# Altium project Power PLC.PrjPcb
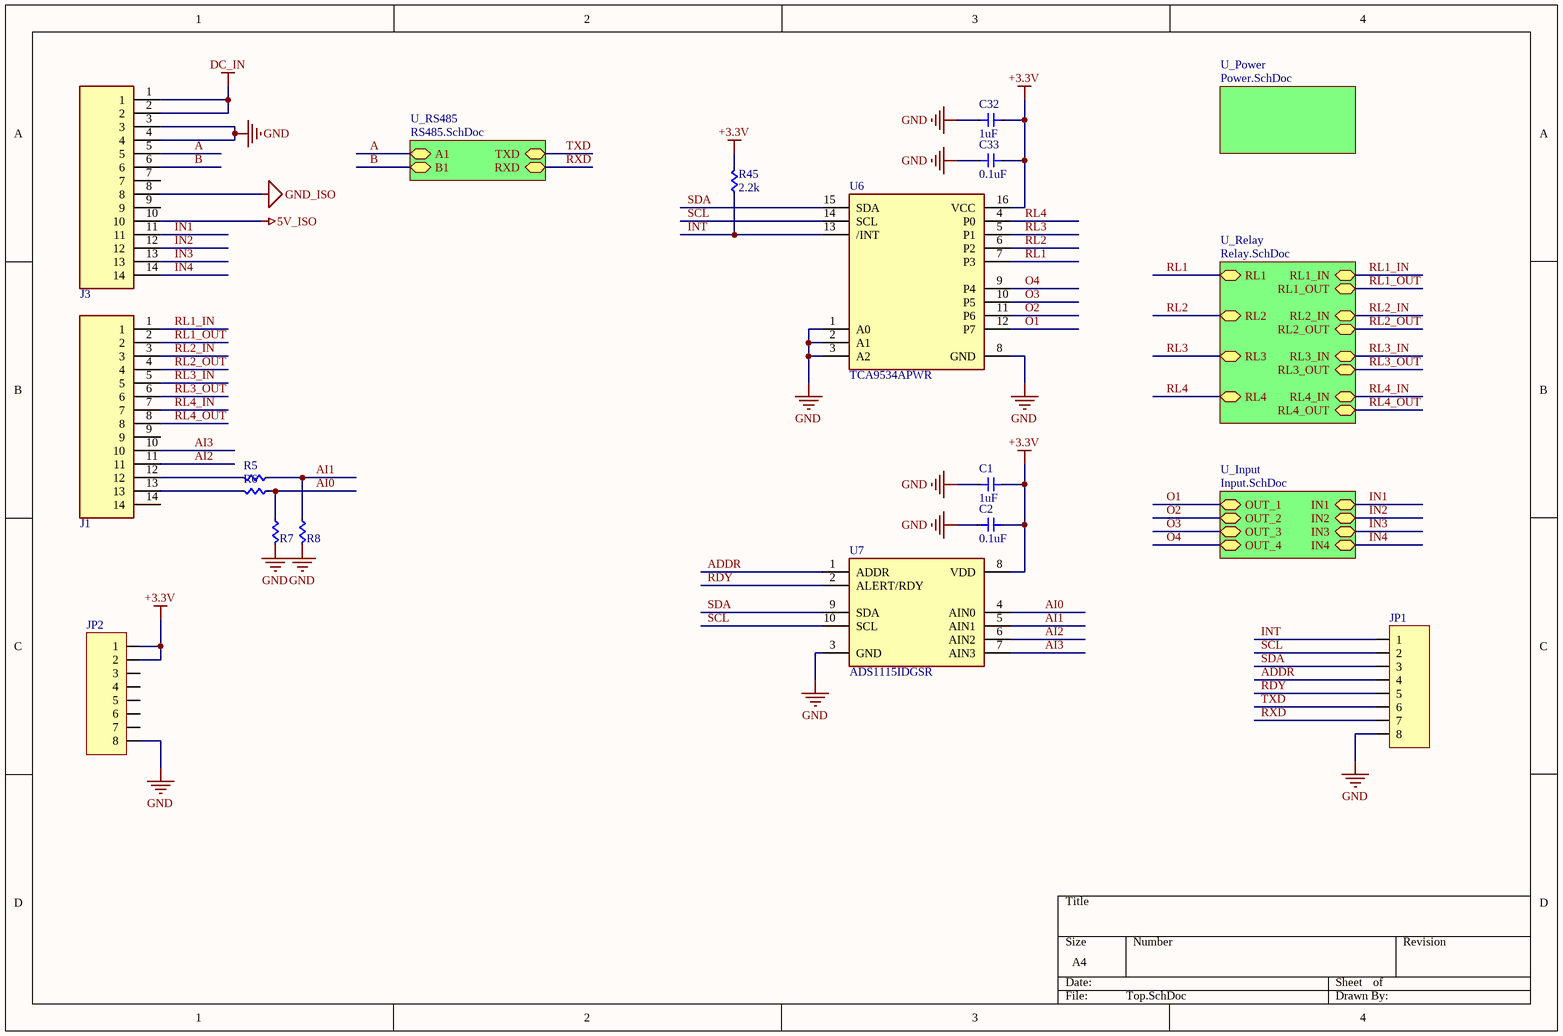
[diagram p0: Top.SchDoc]
5 sheets, 98 parts. Net scope: hierarchical (ports join the sheet entries above them; power ports are global).
Board file: PCB_PLC.PcbDoc
Sheets:
  Top.SchDoc
    U_Power = Power.SchDoc
    U_Relay = Relay.SchDoc
    U_Input = Input.SchDoc
    U_RS485 = RS485.SchDoc

## Sheet Top.SchDoc
size A4; SheetNumber: 1; SheetTotal: 5

### Parts
C1  1uF  [Cap 0603]
C2  0.1uF  [Cap 0603]
C32  1uF  [Cap 0603]
C33  0.1uF  [Cap 0603]
J1  CON 14 EDGR 3.81 RA  [CON 14 EDGR 3.81 RA]  (value not drawn)
J3  CON 14 EDGR 3.81 RA  [CON 14 EDGR 3.81 RA]  (value not drawn)
JP1  JP 1x8 2.54  [JP 1x8 DT]  (value not drawn)
JP2  JP 1x8 2.54  [JP 1x8 DT]  (value not drawn)
R5  RS1  [RES 0603]  (value not drawn)
R6  RS1  [RES 0603]  (value not drawn)
R7  RS2  [RES 0603]  (value not drawn)
R8  RS2  [RES 0603]  (value not drawn)
R45  2.2k  [RES 0603]
U6  TCA9534APWR  [SOP65P640X120-16N]
U7  ADS1115IDGSR  [SOP50P490X110-10N]

### Sub-sheets
U_Input = Input.SchDoc: IN4 (bidir), IN3 (bidir), IN2 (bidir), IN1 (bidir), OUT_1 (bidir), OUT_2 (bidir), OUT_3 (bidir), OUT_4 (bidir)
U_Power = Power.SchDoc: no entries
U_Relay = Relay.SchDoc: RL1 (bidir), RL1_OUT (bidir), RL1_IN (bidir), RL2 (bidir), RL2_OUT (bidir), RL3 (bidir), RL3_OUT (bidir), RL4 (bidir), RL4_OUT (bidir), RL4_IN (bidir), RL2_IN (bidir), RL3_IN (bidir)
U_RS485 = RS485.SchDoc: A1 (bidir), B1 (bidir), RXD (bidir), TXD (bidir)

### Nets
5V_ISO: J3.10
+3.3V: C1.1 C2.1 C32.1 C33.1 JP2.1 JP2.2 R45.2 U6.16(VCC) U7.8(VDD)
DC_IN: J3.1 J3.2
GND: C1.2 C2.2 C32.2 C33.2 J3.3 J3.4 JP1.8 JP2.8 R7.2 R8.2 U6.1(A0) U6.2(A1) U6.3(A2) U6.8(GND) U7.3(GND)
GND_ISO: J3.8
A: J3.5 ; sheet U_RS485/A1
ADDR: JP1.4 U7.1(ADDR)
AI0: R6.1 R7.1 U7.4(AIN0)
AI1: R5.1 R8.1 U7.5(AIN1)
AI2: J1.11 U7.6(AIN2)
AI3: J1.10 U7.7(AIN3)
B: J3.6 ; sheet U_RS485/B1
IN1: J3.11 ; sheet U_Input/IN1
IN2: J3.12 ; sheet U_Input/IN2
IN3: J3.13 ; sheet U_Input/IN3
IN4: J3.14 ; sheet U_Input/IN4
INT: JP1.1 R45.1 U6.13(/INT)
O1: U6.12(P7) ; sheet U_Input/OUT_1
O2: U6.11(P6) ; sheet U_Input/OUT_2
O3: U6.10(P5) ; sheet U_Input/OUT_3
O4: U6.9(P4) ; sheet U_Input/OUT_4
RDY: JP1.5 U7.2(ALERT/RDY)
RL1: U6.7(P3) ; sheet U_Relay/RL1
RL1_IN: J1.1 ; sheet U_Relay/RL1_IN
RL1_OUT: J1.2 ; sheet U_Relay/RL1_OUT
RL2: U6.6(P2) ; sheet U_Relay/RL2
RL2_IN: J1.3 ; sheet U_Relay/RL2_IN
RL2_OUT: J1.4 ; sheet U_Relay/RL2_OUT
RL3: U6.5(P1) ; sheet U_Relay/RL3
RL3_IN: J1.5 ; sheet U_Relay/RL3_IN
RL3_OUT: J1.6 ; sheet U_Relay/RL3_OUT
RL4: U6.4(P0) ; sheet U_Relay/RL4
RL4_IN: J1.7 ; sheet U_Relay/RL4_IN
RL4_OUT: J1.8 ; sheet U_Relay/RL4_OUT
RXD: JP1.7 ; sheet U_RS485/RXD
SCL: JP1.2 U6.14(SCL) U7.10(SCL)
SDA: JP1.3 U6.15(SDA) U7.9(SDA)
TXD: JP1.6 ; sheet U_RS485/TXD
NetJ1_12: J1.12 R5.2
NetJ1_13: J1.13 R6.2

Not connected (* = marked no-connect by the designer): J1 9 14; J3 7 9; JP2 3 4 5 6 7

### Library data of the parts
C1 C2 C32 C33 = Cap 0603: Capacitor SMD 0603
J1 J3 = CON 14 EDGR 3.81 RA: Pluggable,Receptacle, Horizontal, 3.81 Pitch, Terminal Block Connector; MF: {'manufacturer': u'Same Sky (Formerly CUI Devices)'}; MP: TBP02R1-381-14BE; Package: None; Price: None; Value: *; Availability: Unavailable
JP1 JP2 = JP 1x8 2.54 Duc Thang: Cắm; Ten_Linh_Kien: Jump Đơn Đực 2.54MM 1x40P Thẳng 11MM; Don_Vi: Con; Ma_Hang: MH000903; Ghi_Chu: *; Kieu_Chan: *; Chung_Loai: Cắm
R5-R8 R45 = RES 0603: RES SMD 0603; Manufacturer: Vishay Dale; Manufacturer Part Number: CRCW040210K0FKED; Resistance (Ohms): 10k; Tolerance: ±1%; Power (Watts): 0.063W, 1/16W; Temperature Coefficient: ±100ppm/°C; Supplier 1: Digi-Key; RoHS: RoHS Compliant; Category: Resistors; Stock 1: 2392462; Pricing 1: 10=0.083, 50=0.0444, 200=0.0255, 1000=0.0174 (USD); Packaging: Cut Tape (CT); Composition: Thick Film; Features: Automotive AEC-Q200; Operating Temperature: -55°C ~ 155°C; Package / Case: 0402 (1005 Metric); Supplier Device Package: 0402 (1005 Metric); Size / Dimension: 0.039" L x 0.020" W (1.00mm x 0.50mm); Height: 0.016" (0.40mm); Number of Terminations: 2; ComponentLink1URL: http://www.vishay.com/docs/20035/dcrcwe3.pdf; ComponentLink1Description: http://www.vishay.com/docs/20035/dcrcwe3.pdf; Supplier Part Number 1: 541-10.0KLCT-ND
U6 = TCA9534APWR: 8-bit 1.65- to 5.5-V I2C/SMBus I/O expander with interrupt, & config registers; MF: Texas Instruments; SnapEDA_Link: https://www.snapeda.com/parts/TCA9534APWR/Texas+Instruments/view-part/?ref=snap; Package: TSSOP-16 Texas Instruments; Value: *; MP: TCA9534APWR; Check_prices: https://www.snapeda.com/parts/TCA9534APWR/Texas+Instruments/view-part/?ref=eda
U7 = ADS1115IDGSR: 16-bit, 860-SPS, 4-channel, delta-sigma ADC with PGA, oscillator, VREF, comparator and I2C; MF: Texas Instruments; SnapEDA_Link: https://www.snapeda.com/parts/ADS1115IDGSR/Texas+Instruments/view-part/?ref=snap; Package: VSSOP-10 Texas Instruments; Value: *; MP: ADS1115IDGSR; Check_prices: https://www.snapeda.com/parts/ADS1115IDGSR/Texas+Instruments/view-part/?ref=eda

## Sheet Power.SchDoc
size A4; SheetNumber: 2; SheetTotal: 5
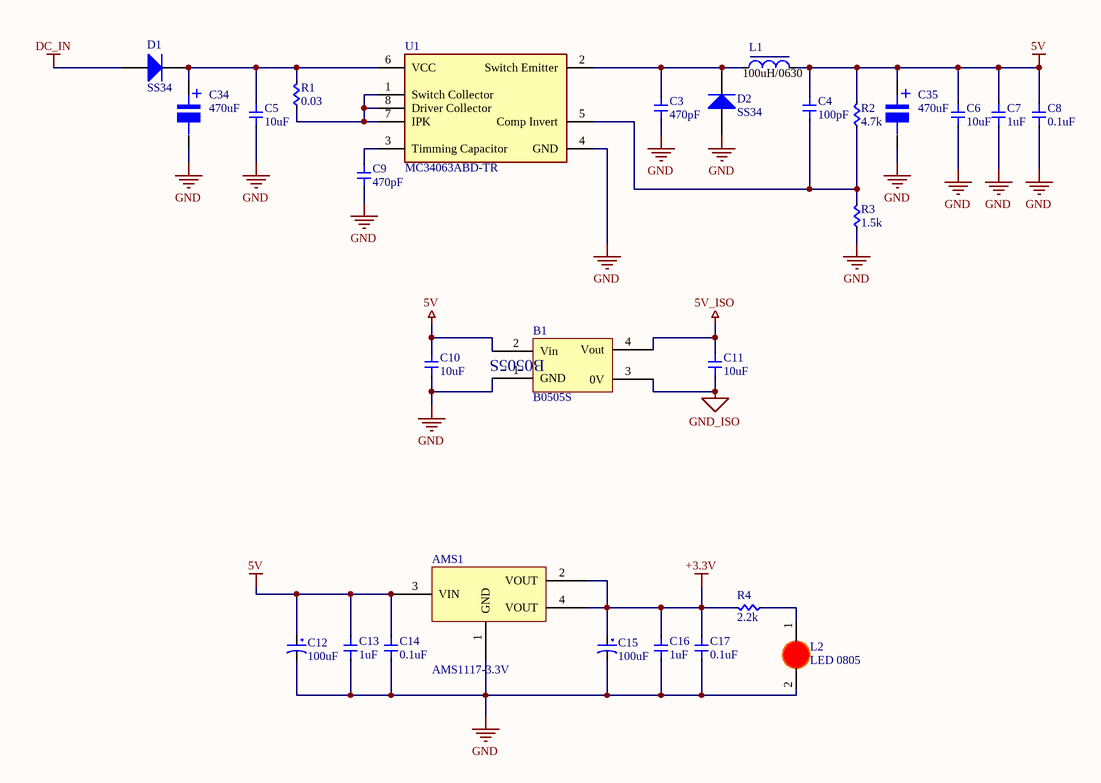
[diagram p1: Power.SchDoc]

### Parts
AMS1  AMS1117-3.3V  [SOT223]
B1  B0505S  [B0505S]
C3  470pF  [Cap 0603]
C4  100pF  [Cap 0603]
C5  10uF  [Cap 1206]
C6  10uF  [Cap 1206]
C7  1uF  [Cap 0603]
C8  0.1uF  [Cap 0603]
C9  470pF  [Cap 0603]
C10  10uF  [Cap 1206]
C11  10uF  [Cap 1206]
C12  100uF  [tu tantalum smd7343]
C13  1uF  [Cap 0603]
C14  0.1uF  [Cap 0603]
C15  100uF  [tu tantalum smd7343]
C16  1uF  [Cap 0603]
C17  0.1uF  [Cap 0603]
C34  470uF  [tu nhom 8 (f)]
C35  470uF  [tu nhom 8 (f)]
D1  SS34  [DIODE SMA]
D2  SS34  [DIODE SMA]
L1  100uH/0630  [INDUCTOR_0630SMD]
L2  LED 0805  [LED-0805-Red]
R1  0.03  [RES 0805]
R2  4.7k  [RES 0603]
R3  1.5k  [RES 0603]
R4  2.2k  [RES 0603]
U1  MC34063ABD-TR  [SOP 8]

### Nets
5V: AMS1.3(VIN) B1.2(Vin) C4.1 C6.1 C7.1 C8.1 C10.1 C12.1 C13.1 C14.1 C35.1 L1.2 R2.2
5V_ISO: B1.4(Vout) C11.1
+3.3V: AMS1.2(VOUT) AMS1.4(VOUT) C15.1 C16.1 C17.1 R4.2
DC_IN: D1.1(A)
GND: AMS1.1(GND) B1.1(GND) C3.2 C5.2 C6.2 C7.2 C8.2 C9.2 C10.2 C12.2 C13.2 C14.2 C15.2 C16.2 C17.2 C34.2 C35.2 D2.1(A) L2.2(K) R3.1 U1.4(GND)
GND_ISO: B1.3(0V) C11.2
NetC3_1: C3.1 D2.2(K) L1.1 U1.2(Switch_Emitter)
NetC4_2: C4.2 R2.1 R3.2 U1.5(Comp_Invert)
NetC5_1: C5.1 C34.1 D1.2(K) R1.2 U1.6(VCC)
NetC9_1: C9.1 U1.3(Timming_Capacitor)
NetL2_1: L2.1(A) R4.1
NetR1_1: R1.1 U1.1(Switch_Collector) U1.7(IPK) U1.8(Driver_Collector)

### Notes on the sheet
- (in symbol Tu Nhom 470uF 16V) +

### Library data of the parts
AMS1 = AMS1117 SMD: Dán; Value: AMS1117-3.3V SOT223; Don_Vi: Con; Ma_Hang: MH000596; Ghi_Chu: *; Kieu_Chan: *; Chung_Loai: Dán
B1 = B0505S: Cắm; Ten_Linh_Kien: B0505S-1W SIP4 IC Converter DC-DC; Don_Vi: Con; Ma_Hang: MH003143; Ghi_Chu: *; Kieu_Chan: *; Chung_Loai: Cắm
C3 C4 C7-C9 C13 C14 C16 C17 = Cap 0603: Capacitor SMD 0603
C5 C6 C10 C11 = Cap 1206: Capacitor SMD 1206
C12 C15 = Tu tantalum 100uF 25V SMD7343: Dán; Don_Vi: Con; So_Chan: 2; Ten_Linh_Kien: Tụ tantalum 107E-100uF 25V SMD7343; Ma_Hang: MH002347; Chung_Loai: Dán; Kieu_Chan: *
C34 C35 = Tu Nhom 470uF 16V: Dán; Don_Vi: Con; So_Chan: 2; Ten_Linh_Kien: Tụ Nhôm 470uF 16V 8x10.4MM; Ma_Hang: MH001940; Chung_Loai: Dán; Kieu_Chan: *
D1 D2 = Diode SS34 ( 1N5822 ): Dán; Don_Vi: Con; Ma_Hang: MH002104; Ten_Linh_Kien: Diode SS34 3A 40V SMA ( 1N5822 SS34A); Kieu_Chan: *; Chung_Loai: Dán
L1 = Inductor Ferrite: Smd Inductors; Code_IEC: 1005; Vendor: Digikey; Published: 8-Jun-2000; LatestRevisionDate: 17-Jul-2002; LatestRevisionNote: Re-released for DXP Platform.; PackageReference: 0402-A; Publisher: Altium Limited; Code_JEITA: 0402; ComponentLink1Description: Digikey Part Link; ComponentLink2Description: Open Datasheet; ComponentLink2URL: H:\LIBRARY\LIBRARY.Datasheet\; Value: 100uH/0630
L2 = LED 0805 Do: Dán; Don_Vi: Con; Ma_Hang: MH000897; Ten_Linh_Kien: LED 0805 Màu Đỏ (Red); Ghi_Chu: *; Kieu_Chan: *; Chung_Loai: Dán
R1 = RES 0805: RES SMD 0805; Manufacturer: Vishay Dale; Manufacturer Part Number: CRCW040210K0FKED; Resistance (Ohms): 10k; Tolerance: ±1%; Power (Watts): 0.063W, 1/16W; Temperature Coefficient: ±100ppm/°C; Supplier 1: Digi-Key; RoHS: RoHS Compliant; Category: Resistors; Stock 1: 2392462; Pricing 1: 10=0.083, 50=0.0444, 200=0.0255, 1000=0.0174 (USD); Packaging: Cut Tape (CT); Composition: Thick Film; Features: Automotive AEC-Q200; Operating Temperature: -55°C ~ 155°C; Package / Case: 0402 (1005 Metric); Supplier Device Package: 0402 (1005 Metric); Size / Dimension: 0.039" L x 0.020" W (1.00mm x 0.50mm); Height: 0.016" (0.40mm); Number of Terminations: 2; ComponentLink1URL: http://www.vishay.com/docs/20035/dcrcwe3.pdf; ComponentLink1Description: http://www.vishay.com/docs/20035/dcrcwe3.pdf; Supplier Part Number 1: 541-10.0KLCT-ND
R2-R4 = RES 0603: as R5 on sheet Top; Supplier 1: Digi-Key; RoHS: RoHS Compliant; Category: Resistors; Stock 1: 2392462; Pricing 1: 10=0.083, 50=0.0444, 200=0.0255, 1000=0.0174 (USD); Packaging: Cut Tape (CT); Composition: Thick Film; Features: Automotive AEC-Q200; Operating Temperature: -55°C ~ 155°C; Package / Case: 0402 (1005 Metric); Supplier Device Package: 0402 (1005 Metric); Size / Dimension: 0.039" L x 0.020" W (1.00mm x 0.50mm); Height: 0.016" (0.40mm); Number of Terminations: 2; ComponentLink1URL: http://www.vishay.com/docs/20035/dcrcwe3.pdf; ComponentLink1Description: http://www.vishay.com/docs/20035/dcrcwe3.pdf; Supplier Part Number 1: 541-10.0KLCT-ND
U1 = MC34063ABD-TR: Buck, Boost Switching Regulator IC Positive or Negative Adjustable 1.25V 1 Output 1.5A (Switch) 8-SOIC (0.154, 3.90mm Width); MF: STMicroelectronics; SnapEDA_Link: https://www.snapeda.com/parts/MC34063ABD-TR/STMicroelectronics/view-part/?ref=snap; Package: None; Value: *; MP: MC34063ABD-TR; Check_prices: https://www.snapeda.com/parts/MC34063ABD-TR/STMicroelectronics/view-part/?ref=eda

## Sheet Relay.SchDoc
size A4; SheetNumber: 4; SheetTotal: 5
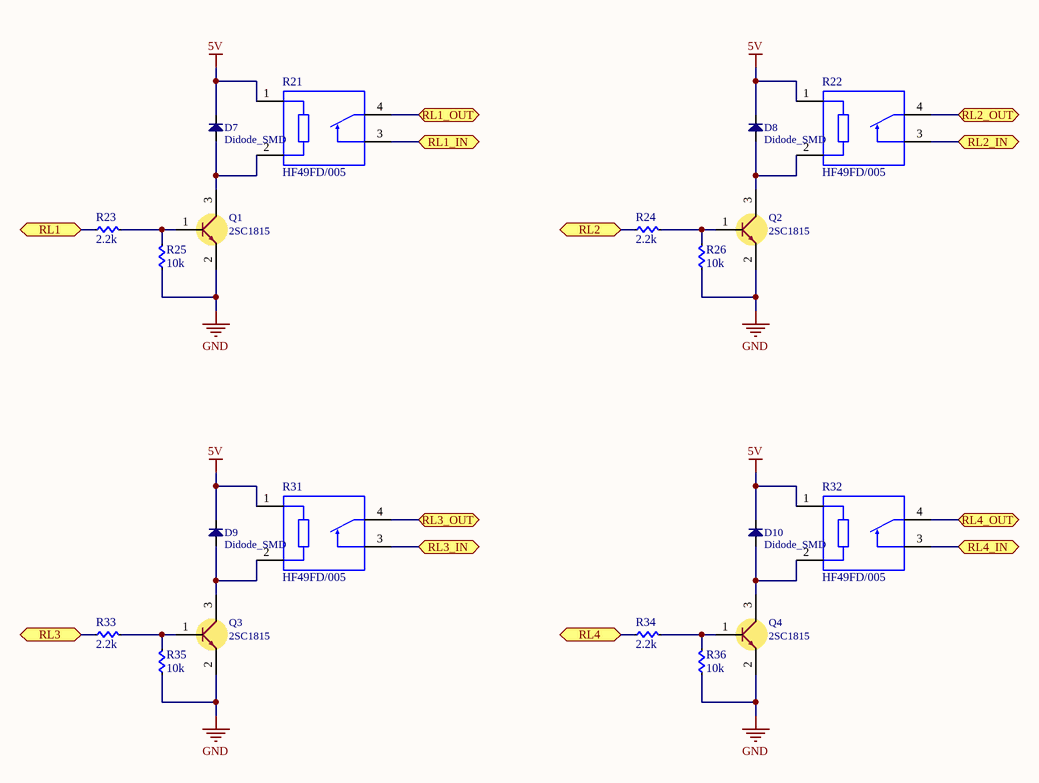
[diagram p2: Relay.SchDoc]

### Parts
D7  Didode_SMD  [SOD-123]
D8  Didode_SMD  [SOD-123]
D9  Didode_SMD  [SOD-123]
D10  Didode_SMD  [SOD-123]
Q1  2SC1815  [SOT23]
Q2  2SC1815  [SOT23]
Q3  2SC1815  [SOT23]
Q4  2SC1815  [SOT23]
R21  HF49FD/005  [RELAY_HF49FD/005-1H12T]
R22  HF49FD/005  [RELAY_HF49FD/005-1H12T]
R23  2.2k  [RES 0603]
R24  2.2k  [RES 0603]
R25  10k  [RES 0603]
R26  10k  [RES 0603]
R31  HF49FD/005  [RELAY_HF49FD/005-1H12T]
R32  HF49FD/005  [RELAY_HF49FD/005-1H12T]
R33  2.2k  [RES 0603]
R34  2.2k  [RES 0603]
R35  10k  [RES 0603]
R36  10k  [RES 0603]

### Ports
RL1 (bidir), RL1_IN (bidir), RL1_OUT (bidir), RL2 (bidir), RL2_IN (bidir), RL2_OUT (bidir), RL3 (bidir), RL3_IN (bidir), RL3_OUT (bidir), RL4 (bidir), RL4_IN (bidir), RL4_OUT (bidir)

### Nets
5V: D7.2(K) D8.2(K) D9.2(K) D10.2(K) R21.1(L1) R22.1(L1) R31.1(L1) R32.1(L1)
GND: Q1.2(E) Q2.2(E) Q3.2(E) Q4.2(E) R25.1 R26.1 R35.1 R36.1
RL1: R23.1 ; port RL1
RL1_IN: R21.3(C2) ; port RL1_IN
RL1_OUT: R21.4(C1) ; port RL1_OUT
RL2: R24.1 ; port RL2
RL2_IN: R22.3(C2) ; port RL2_IN
RL2_OUT: R22.4(C1) ; port RL2_OUT
RL3: R33.1 ; port RL3
RL3_IN: R31.3(C2) ; port RL3_IN
RL3_OUT: R31.4(C1) ; port RL3_OUT
RL4: R34.1 ; port RL4
RL4_IN: R32.3(C2) ; port RL4_IN
RL4_OUT: R32.4(C1) ; port RL4_OUT
NetD7_1: D7.1(A) Q1.3(C) R21.2(L2)
NetD8_1: D8.1(A) Q2.3(C) R22.2(L2)
NetD9_1: D9.1(A) Q3.3(C) R31.2(L2)
NetD10_1: D10.1(A) Q4.3(C) R32.2(L2)
NetQ1_1: Q1.1(B) R23.2 R25.2
NetQ2_1: Q2.1(B) R24.2 R26.2
NetQ3_1: Q3.1(B) R33.2 R35.2
NetQ4_1: Q4.1(B) R34.2 R36.2

### Library data of the parts
D7-D10 = Didode_SMD: Vendor: Digikey; Value: FR307; Current: 3Amp; Published: 8-Jun-2000; LatestRevisionDate: 17-Jul-2002; LatestRevisionNote: Re-released for DXP Platform.; DatasheetDocument: 1997; PackageReference: DO-35; Publisher: Altium Limited; Code_JEDEC: DO-204-AH; ComponentLink1Description: Digikey Part Link; ComponentLink1URL: http://www.fairchildsemi.com/; ComponentLink2Description: Open Datasheet; ComponentLink2URL: H:\LIBRARY\LIBRARY.Datasheet\ds26003.pdf
Q1-Q4 = NPN_SMD: SMD TRANSISTOR
R21 R22 R31 R32 = Relay HF49FD: Relay: electromagnetic; SPST-NO; Ucoil: 5VDC; 5A/250VAC; 5A/30VDC
R23 R24 R33 R34 = RES 0603: as R5 on sheet Top; Supplier 1: Digi-Key; RoHS: RoHS Compliant; Category: Resistors; Stock 1: 2392462; Pricing 1: 10=0.083, 50=0.0444, 200=0.0255, 1000=0.0174 (USD); Packaging: Cut Tape (CT); Composition: Thick Film; Features: Automotive AEC-Q200; Operating Temperature: -55°C ~ 155°C; Package / Case: 0402 (1005 Metric); Supplier Device Package: 0402 (1005 Metric); Size / Dimension: 0.039" L x 0.020" W (1.00mm x 0.50mm); Height: 0.016" (0.40mm); Number of Terminations: 2; ComponentLink1URL: http://www.vishay.com/docs/20035/dcrcwe3.pdf; ComponentLink1Description: http://www.vishay.com/docs/20035/dcrcwe3.pdf; Supplier Part Number 1: 541-10.0KLCT-ND
R25 R26 R35 R36 = RES 0603: RES SMD 0603; Manufacturer: Vishay Dale; Manufacturer Part Number: CRCW040210K0FKED; Tolerance: ±1%; Power (Watts): 0.063W, 1/16W; Temperature Coefficient: ±100ppm/°C; Supplier 1: Digi-Key; RoHS: RoHS Compliant; Category: Resistors; Stock 1: 2392462; Pricing 1: 10=0.083, 50=0.0444, 200=0.0255, 1000=0.0174 (USD); Packaging: Cut Tape (CT); Resistance (Ohms): 10k; Composition: Thick Film; Features: Automotive AEC-Q200; Operating Temperature: -55°C ~ 155°C; Package / Case: 0402 (1005 Metric); Supplier Device Package: 0402 (1005 Metric); Size / Dimension: 0.039" L x 0.020" W (1.00mm x 0.50mm); Height: 0.016" (0.40mm); Number of Terminations: 2; ComponentLink1URL: http://www.vishay.com/docs/20035/dcrcwe3.pdf; ComponentLink1Description: http://www.vishay.com/docs/20035/dcrcwe3.pdf; Supplier Part Number 1: 541-10.0KLCT-ND

## Sheet Input.SchDoc
size A4; SheetNumber: 6; SheetTotal: 7
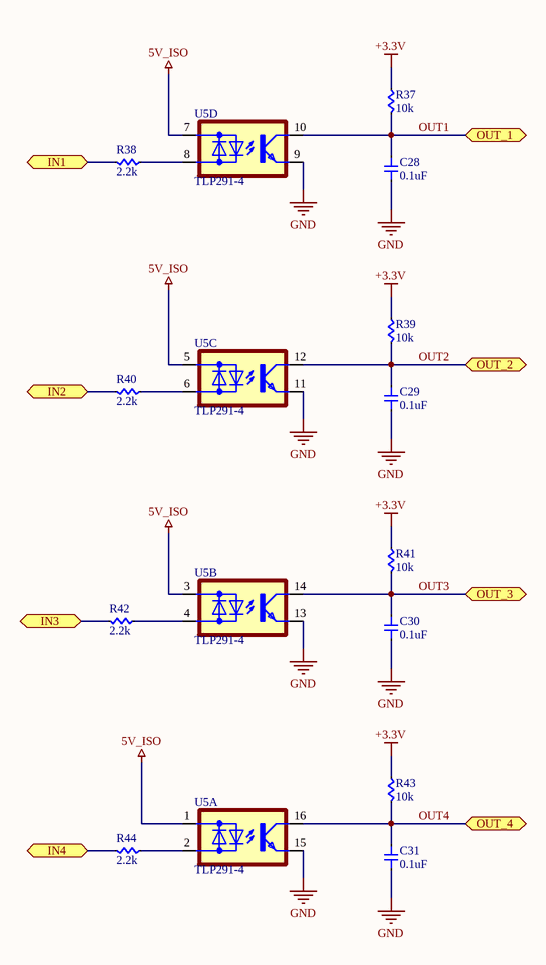
[diagram p3: Input.SchDoc]

### Parts
C28  0.1uF  [Cap 0603]
C29  0.1uF  [Cap 0603]
C30  0.1uF  [Cap 0603]
C31  0.1uF  [Cap 0603]
R37  10k  [RES 0603]
R38  2.2k  [RES 0603]
R39  10k  [RES 0603]
R40  2.2k  [RES 0603]
R41  10k  [RES 0603]
R42  2.2k  [RES 0603]
R43  10k  [RES 0603]
R44  2.2k  [RES 0603]
U5  TLP291-4  [SOP16_TLP2xx]  (parts A,B,C,D of 4)

### Ports
IN1 (bidir), IN2 (bidir), IN3 (bidir), IN4 (bidir), OUT_1 (bidir), OUT_2 (bidir), OUT_3 (bidir), OUT_4 (bidir)

### Nets
5V_ISO: U5.1(AC1) U5.3(AC1) U5.5(AC1) U5.7(AC1)
+3.3V: R37.1 R39.1 R41.1 R43.1
GND: C28.2 C29.2 C30.2 C31.2 U5.9(E) U5.11(E) U5.13(E) U5.15(E)
IN1: R38.2 ; port IN1
IN2: R40.2 ; port IN2
IN3: R42.2 ; port IN3
IN4: R44.2 ; port IN4
OUT1: C28.1 R37.2 U5.10(C) ; port OUT_1  [project net O1]
OUT2: C29.1 R39.2 U5.12(C) ; port OUT_2  [project net O2]
OUT3: C30.1 R41.2 U5.14(C) ; port OUT_3  [project net O3]
OUT4: C31.1 R43.2 U5.16(C) ; port OUT_4  [project net O4]
NetR38_1: R38.1 U5.8(AC2)
NetR40_1: R40.1 U5.6(AC2)
NetR42_1: R42.1 U5.4(AC2)
NetR44_1: R44.1 U5.2(AC2)

### Library data of the parts
C28-C31 = Cap 0603: Capacitor SMD 0603
R37 R39 R41 R43 = RES 0603: as R25 on sheet Relay; Supplier 1: Digi-Key; RoHS: RoHS Compliant; Category: Resistors; Stock 1: 2392462; Pricing 1: 10=0.083, 50=0.0444, 200=0.0255, 1000=0.0174 (USD); Packaging: Cut Tape (CT); Resistance (Ohms): 10k; Composition: Thick Film; Features: Automotive AEC-Q200; Operating Temperature: -55°C ~ 155°C; Package / Case: 0402 (1005 Metric); Supplier Device Package: 0402 (1005 Metric); Size / Dimension: 0.039" L x 0.020" W (1.00mm x 0.50mm); Height: 0.016" (0.40mm); Number of Terminations: 2; ComponentLink1URL: http://www.vishay.com/docs/20035/dcrcwe3.pdf; ComponentLink1Description: http://www.vishay.com/docs/20035/dcrcwe3.pdf; Supplier Part Number 1: 541-10.0KLCT-ND
R38 R40 R42 R44 = RES 0603: as R5 on sheet Top; Supplier 1: Digi-Key; RoHS: RoHS Compliant; Category: Resistors; Stock 1: 2392462; Pricing 1: 10=0.083, 50=0.0444, 200=0.0255, 1000=0.0174 (USD); Packaging: Cut Tape (CT); Composition: Thick Film; Features: Automotive AEC-Q200; Operating Temperature: -55°C ~ 155°C; Package / Case: 0402 (1005 Metric); Supplier Device Package: 0402 (1005 Metric); Size / Dimension: 0.039" L x 0.020" W (1.00mm x 0.50mm); Height: 0.016" (0.40mm); Number of Terminations: 2; ComponentLink1URL: http://www.vishay.com/docs/20035/dcrcwe3.pdf; ComponentLink1Description: http://www.vishay.com/docs/20035/dcrcwe3.pdf; Supplier Part Number 1: 541-10.0KLCT-ND
U5 = OPTO TLP291-4: Optoisolator Transistor Output 2500Vrms 4 Channel 16-SOP; MF: Toshiba Semiconductor; MP: TLP 280-4; SnapEDA_Link: https://www.snapeda.com/parts/TLP%20280-4/Toshiba/view-part/?ref=snap; Package: SOP-16 Toshiba; Value: *; Check_prices: https://www.snapeda.com/parts/TLP%20280-4/Toshiba/view-part/?ref=eda

## Sheet RS485.SchDoc
size A4; SheetNumber: 4; SheetTotal: 7
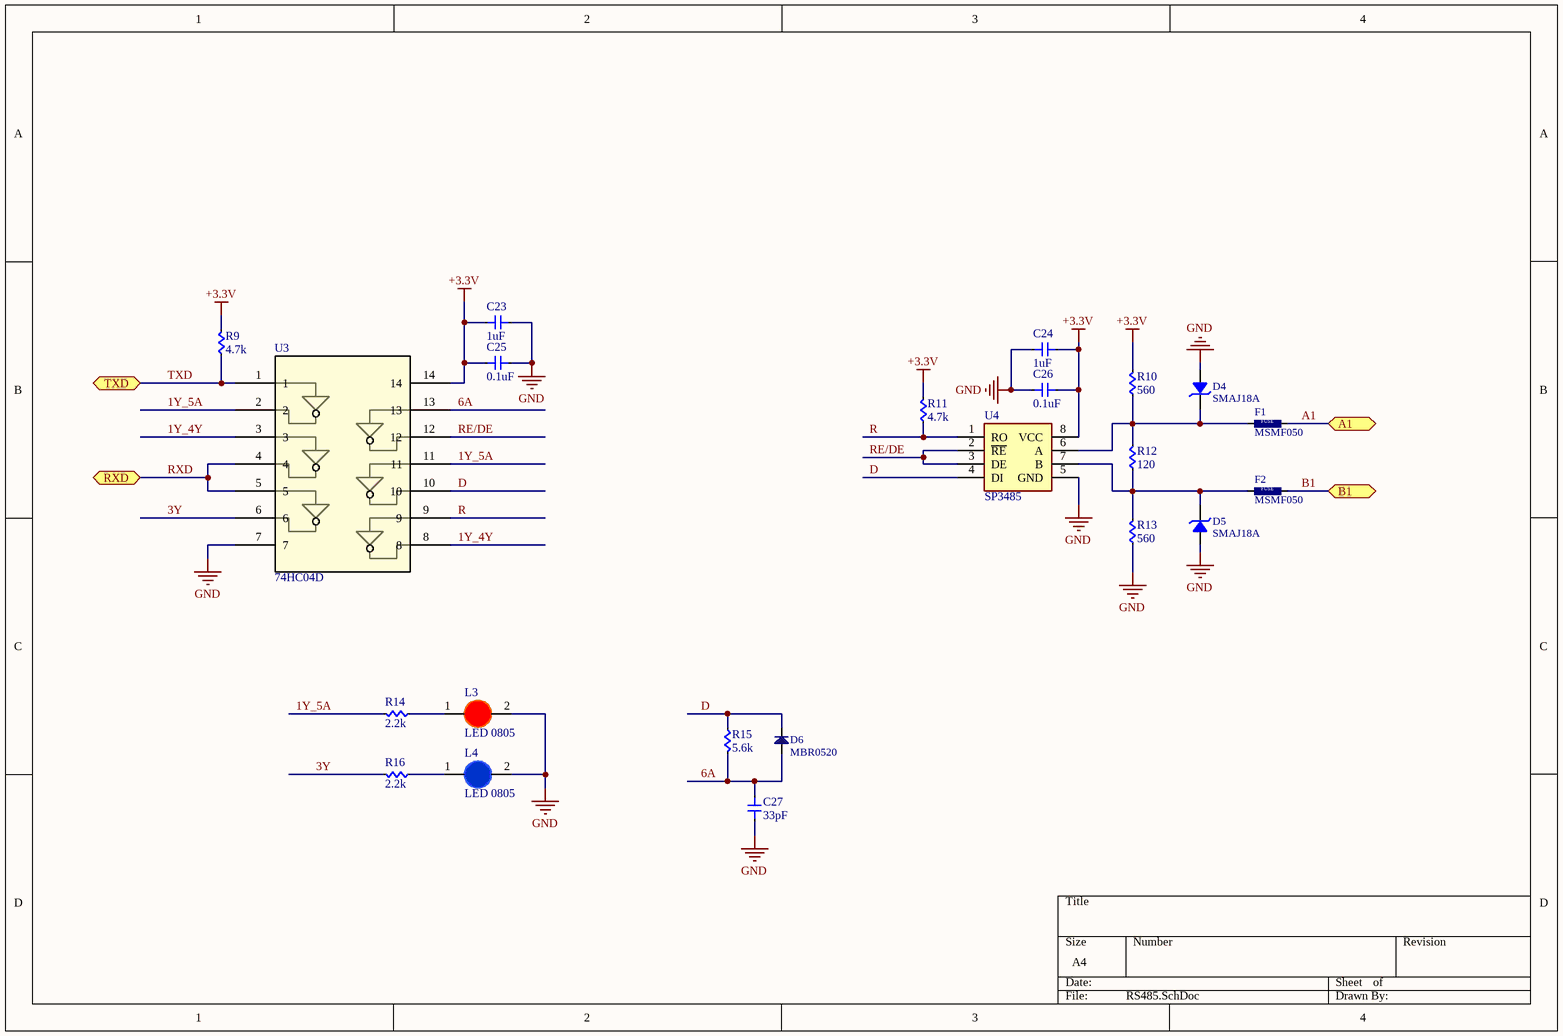
[diagram p4: RS485.SchDoc]

### Parts
C23  1uF  [Cap 0603]
C24  1uF  [Cap 0603]
C25  0.1uF  [Cap 0603]
C26  0.1uF  [Cap 0603]
C27  33pF  [Cap 0603]
D4  SMAJ18A  [DO-214AC,SMA]
D5  SMAJ18A  [DO-214AC,SMA]
D6  MBR0520  [SOD-123]
F1  MSMF050  [FUSE_PTC]
F2  MSMF050  [FUSE_PTC]
L3  LED 0805  [LED-0805-Red]
L4  LED 0805  [LED-0805-Blue]
R9  4.7k  [RES 0603]
R10  560  [RES 0805]
R11  4.7k  [RES 0603]
R12  120  [RES 0805]
R13  560  [RES 0805]
R14  2.2k  [RES 0603]
R15  5.6k  [RES 0603]
R16  2.2k  [RES 0603]
U3  74HC04D  [SOIC14_50_285_80X25_SMT]
U4  SP3485  [SOIC8_50_328_25X90_SMT]

### Ports
A1 (bidir), B1 (bidir), RXD (bidir), TXD (bidir)

### Nets
+3.3V: C23.1 C24.1 C25.1 C26.1 R9.2 R10.2 R11.2 U3.14 U4.8(VCC)
GND: C23.2 C24.2 C25.2 C26.2 C27.1 D4.1(A) D5.1(A) L3.2(K) L4.2(K) R13.1 U3.7 U4.5(GND)
1Y_4Y: U3.3 U3.8
1Y_5A: R14.2 U3.2 U3.11
3Y: R16.2 U3.6
6A: C27.2 D6.1(A) R15.2 U3.13
A1: F1.2 ; port A1  [project net A]
B1: F2.2 ; port B1  [project net B]
D: D6.2(K) R15.1 U3.10 U4.4(DI)
R: R11.1 U3.9 U4.1(RO)
RE/DE: U3.12 U4.2(~{RE}) U4.3(DE)
RXD: U3.4 U3.5 ; port RXD
TXD: R9.1 U3.1 ; port TXD
NetD4_2: D4.2(K) F1.1 R10.1 R12.2 U4.6(A)
NetD5_2: D5.2(K) F2.1 R12.1 R13.2 U4.7(B)
NetL3_1: L3.1(A) R14.1
NetL4_1: L4.1(A) R16.1

### Notes on the sheet
- (in symbol Fuse_smd) FUSE

### Library data of the parts
C23-C27 = Cap 0603: Capacitor SMD 0603
D4 D5 = Diode_TVS: Zener Diode; Published: 8-Jun-2000; LatestRevisionDate: 17-Jul-2002; LatestRevisionNote: Re-released for DXP Platform.; PackageReference: DIODE-0.7; Publisher: Altium Limited; PackageDescription: Diode, Thru-Hole; 2 Leads; 0.7 in Pin Spacing
D6 = Didode_MBR0520: Vendor: Digikey; Value: FR307; Current: 3Amp; Published: 8-Jun-2000; LatestRevisionDate: 17-Jul-2002; LatestRevisionNote: Re-released for DXP Platform.; DatasheetDocument: 1997; PackageReference: DO-35; Publisher: Altium Limited; Code_JEDEC: DO-204-AH; ComponentLink1Description: Digikey Part Link; ComponentLink1URL: http://www.fairchildsemi.com/; ComponentLink2Description: Open Datasheet; ComponentLink2URL: H:\LIBRARY\LIBRARY.Datasheet\ds26003.pdf
F1 F2 = Fuse_smd
L3 = LED 0805 Do: as L2 on sheet Power; Ghi_Chu: *; Kieu_Chan: *; Chung_Loai: Dán
L4 = LED 0805 Xanh Duong: Dán; Don_Vi: Con; Ma_Hang: MH002327; Ten_Linh_Kien: LED 0805 Màu Xanh Dương (Blue); Ghi_Chu: *; Kieu_Chan: *; Chung_Loai: Dán
R9 R11 R14-R16 = RES 0603: as R5 on sheet Top; Supplier 1: Digi-Key; RoHS: RoHS Compliant; Category: Resistors; Stock 1: 2392462; Pricing 1: 10=0.083, 50=0.0444, 200=0.0255, 1000=0.0174 (USD); Packaging: Cut Tape (CT); Composition: Thick Film; Features: Automotive AEC-Q200; Operating Temperature: -55°C ~ 155°C; Package / Case: 0402 (1005 Metric); Supplier Device Package: 0402 (1005 Metric); Size / Dimension: 0.039" L x 0.020" W (1.00mm x 0.50mm); Height: 0.016" (0.40mm); Number of Terminations: 2; ComponentLink1URL: http://www.vishay.com/docs/20035/dcrcwe3.pdf; ComponentLink1Description: http://www.vishay.com/docs/20035/dcrcwe3.pdf; Supplier Part Number 1: 541-10.0KLCT-ND
R10 R12 R13 = RES 0805: as R1 on sheet Power; Supplier 1: Digi-Key; RoHS: RoHS Compliant; Category: Resistors; Stock 1: 2392462; Pricing 1: 10=0.083, 50=0.0444, 200=0.0255, 1000=0.0174 (USD); Packaging: Cut Tape (CT); Composition: Thick Film; Features: Automotive AEC-Q200; Operating Temperature: -55°C ~ 155°C; Package / Case: 0402 (1005 Metric); Supplier Device Package: 0402 (1005 Metric); Size / Dimension: 0.039" L x 0.020" W (1.00mm x 0.50mm); Height: 0.016" (0.40mm); Number of Terminations: 2; ComponentLink1URL: http://www.vishay.com/docs/20035/dcrcwe3.pdf; ComponentLink1Description: http://www.vishay.com/docs/20035/dcrcwe3.pdf; Supplier Part Number 1: 541-10.0KLCT-ND
U3 = 74HC04D: Hex Inverter, SOIC14; Manufacturer_Name: Toshiba Electronic Devices & Storage Corp.; Copyright: Copyright (C) 2025 Ultra Librarian. All rights reserved.; Manufacturer_Part_Number: 74HC04D; RefDes: RefDes; Type: Type

## Nets that join several sheets
5V: Power (13 pins), Relay (8 pins)
5V_ISO: Top (J3.10), Power (B1.4 C11.1), Input (U5.1 U5.3 U5.5 U5.7)
+3.3V: Top (9 pins), Power (6 pins), Input (R37.1 R39.1 R41.1 R43.1), RS485 (9 pins)
DC_IN: Top (J3.1 J3.2), Power (D1.1)
GND: Top (15 pins), Power (21 pins), Relay (8 pins), Input (8 pins), RS485 (12 pins)
GND_ISO: Top (J3.8), Power (B1.3 C11.2)
A: Top (J3.5), RS485 (F1.2)
B: Top (J3.6), RS485 (F2.2)
IN1: Top (J3.11), Input (R38.2)
IN2: Top (J3.12), Input (R40.2)
IN3: Top (J3.13), Input (R42.2)
IN4: Top (J3.14), Input (R44.2)
O1: Top (U6.12), Input (C28.1 R37.2 U5.10)
O2: Top (U6.11), Input (C29.1 R39.2 U5.12)
O3: Top (U6.10), Input (C30.1 R41.2 U5.14)
O4: Top (U6.9), Input (C31.1 R43.2 U5.16)
RL1: Top (U6.7), Relay (R23.1)
RL1_IN: Top (J1.1), Relay (R21.3)
RL1_OUT: Top (J1.2), Relay (R21.4)
RL2: Top (U6.6), Relay (R24.1)
RL2_IN: Top (J1.3), Relay (R22.3)
RL2_OUT: Top (J1.4), Relay (R22.4)
RL3: Top (U6.5), Relay (R33.1)
RL3_IN: Top (J1.5), Relay (R31.3)
RL3_OUT: Top (J1.6), Relay (R31.4)
RL4: Top (U6.4), Relay (R34.1)
RL4_IN: Top (J1.7), Relay (R32.3)
RL4_OUT: Top (J1.8), Relay (R32.4)
RXD: Top (JP1.7), RS485 (U3.4 U3.5)
TXD: Top (JP1.6), RS485 (R9.1 U3.1)